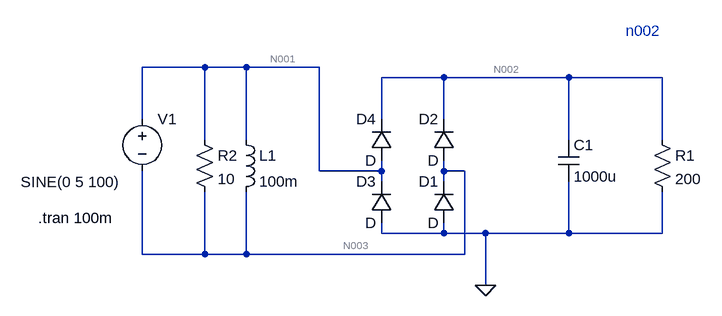
[diagram p0: schematic D-33_v-3-0_Full-rectifier+Coil.asc]
D-33_v-3-0_Full-rectifier+Coil.asc, the LTspice schematic file:
Version 4
SHEET 1 916 680
WIRE -464 -80 -560 -80
WIRE -400 -80 -464 -80
WIRE -288 -80 -400 -80
WIRE -96 -64 -192 -64
WIRE 96 -64 -96 -64
WIRE 240 -64 96 -64
WIRE -560 0 -560 -80
WIRE -192 0 -192 -64
WIRE -96 0 -96 -64
WIRE -464 32 -464 -80
WIRE -400 32 -400 -80
WIRE 96 32 96 -64
WIRE 240 32 240 -64
WIRE -288 80 -288 -80
WIRE -192 80 -192 64
WIRE -192 80 -288 80
WIRE -96 80 -96 64
WIRE -64 80 -96 80
WIRE -192 96 -192 80
WIRE -96 96 -96 80
WIRE -192 176 -192 160
WIRE -96 176 -96 160
WIRE -96 176 -192 176
WIRE -32 176 -96 176
WIRE 96 176 96 96
WIRE 96 176 -32 176
WIRE 240 176 240 112
WIRE 240 176 96 176
WIRE -560 208 -560 80
WIRE -464 208 -464 112
WIRE -464 208 -560 208
WIRE -400 208 -400 112
WIRE -400 208 -464 208
WIRE -64 208 -64 80
WIRE -64 208 -400 208
WIRE -32 256 -32 176
FLAG -32 256 0
SYMBOL diode -80 160 R180
WINDOW 0 24 64 Left 2
WINDOW 3 24 0 Left 2
SYMATTR InstName D1
SYMBOL diode -80 64 R180
WINDOW 0 24 64 Left 2
WINDOW 3 24 0 Left 2
SYMATTR InstName D2
SYMBOL diode -176 160 R180
WINDOW 0 24 64 Left 2
WINDOW 3 24 0 Left 2
SYMATTR InstName D3
SYMBOL diode -176 64 R180
WINDOW 0 24 64 Left 2
WINDOW 3 24 0 Left 2
SYMATTR InstName D4
SYMBOL res 224 16 R0
SYMATTR InstName R1
SYMATTR Value 200
SYMBOL voltage -560 -16 R0
WINDOW 3 -187 113 Left 2
WINDOW 123 0 0 Left 2
WINDOW 39 0 0 Left 2
SYMATTR Value SINE(0 5 100)
SYMATTR InstName V1
SYMBOL cap 80 32 R0
SYMATTR InstName C1
SYMATTR Value 1000u
SYMBOL ind -416 16 R0
SYMATTR InstName L1
SYMATTR Value 100m
SYMBOL res -480 16 R0
SYMATTR InstName R2
SYMATTR Value 10
TEXT -720 152 Left 2 !.tran 100m
TEXT 184 -136 Left 2 ;n002

The netlist it stands for:
* D-33_v-3-0_Full-rectifier+Coil.asc
D1 0 N003 D
D2 N003 N002 D
D3 0 N001 D
D4 N001 N002 D
R1 N002 0 200
V1 N001 N003 SINE(0 5 100)
C1 N002 0 1000u
L1 N001 N003 100m
R2 N001 N003 10
.model D D
.lib standard.dio
.tran 100m
* n002
.backanno
.end

* Results of the author's LTspice run, read from the files saved beside the schematic
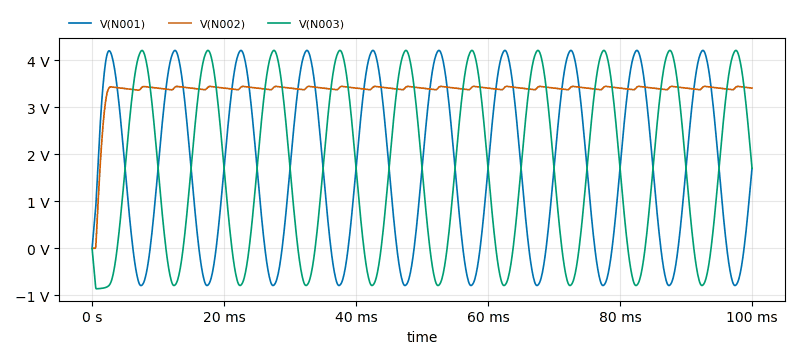
[diagram p1: Transient Analysis of D-33_v-3-0_Full-rectifier+Coil.asc, plotted from the saved traces]
* Transient Analysis, 1 run:
*   V(N001): min -793.2 mV, max 4.21 V, average 1.683 V, rms 2.436 V, last 1.704 V
*   V(N002): min 0 V, max 3.443 V, average 3.365 V, rms 3.382 V, last 3.407 V
*   V(N003): min -861.1 mV, max 4.21 V, average 1.683 V, rms 2.454 V, last 1.704 V